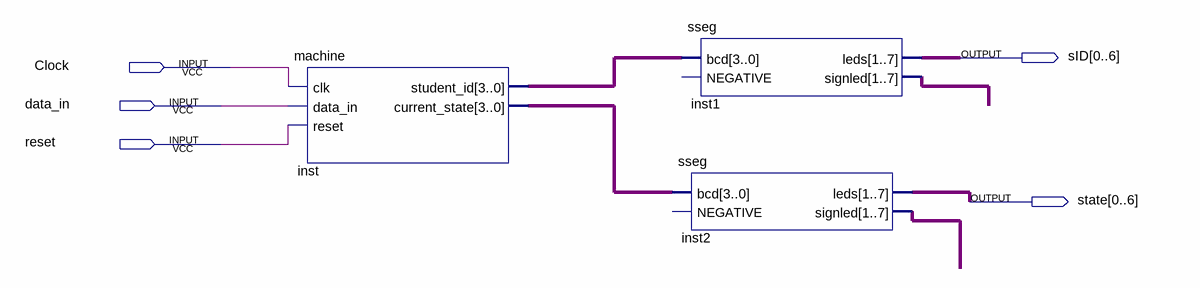
[diagram p0: schematic sheet]
// Quartus schematic test.bdf as structural Verilog: 3 symbols, 5 pins
module test (
  input  Clock,
  input  data_in,
  input  reset,
  output [0:6] sID,
  output [0:6] state
);

  wire [3:0] inst_current_state, inst_student_id;
  wire [6:0] inst1_signled, inst2_signled;

  machine inst (
    .clk(Clock), .data_in(data_in), .reset(reset), .student_id(inst_student_id),
    .current_state(inst_current_state));
  sseg inst2 (.bcd(inst_current_state), .leds(state), .signled(inst2_signled));  // open: NEGATIVE
  sseg inst1 (.bcd(inst_student_id), .leds(sID), .signled(inst1_signled));  // open: NEGATIVE
endmodule
